# EAGLE design BrainPadWiFi (EAGLE 9.1.3)
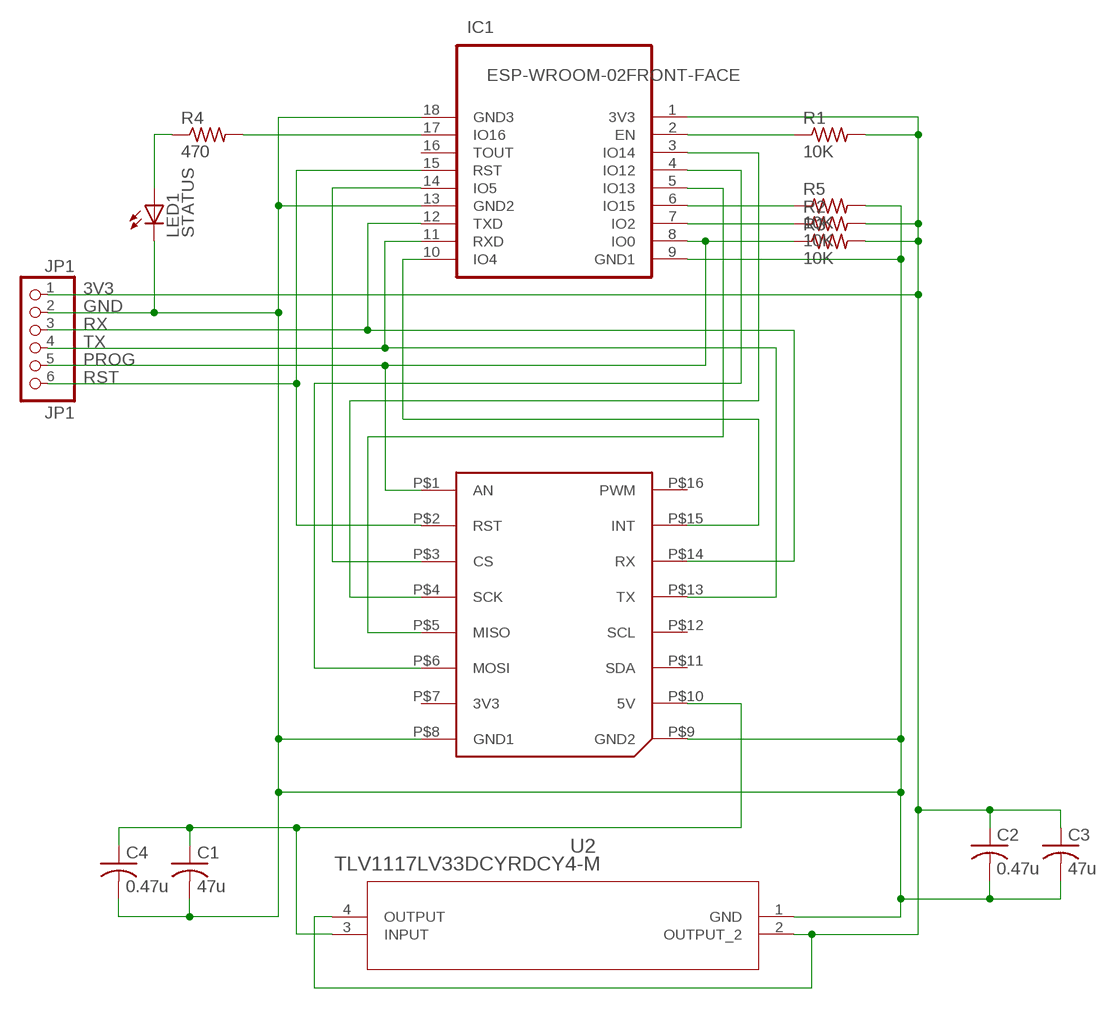
[diagram p0: schematic, sheet 1]

## Parts
C1  47u  C-USC1206  [C1206]
C2  0.47u  C-USC1206  [C1206]
C3  47u  C-USC1206  [C1206]
C4  0.47u  C-USC1206  [C1206]
IC1  ESP-WROOM-02FRONT-FACE  [FRONT-FACE]
JP1  JP1  PINHD-1X6  [1X06]
LED1  STATUS  LEDSML1206  [SML1206]
R1  10K  R-US_R1206  [R1206]
R2  10K  R-US_R1206  [R1206]
R3  10K  R-US_R1206  [R1206]
R4  470  R-US_R1206  [R1206]
R5  10K  R-US_R1206  [R1206]
U2  TLV1117LV33DCYRDCY4-M  [DCY4-M]
U$1  MIKROE_CLICKMINI  [MIKROE_BUS_MINI]

## Nets
3V3: C2.1 C3.1 IC1.1(3V3) JP1.1 R1.2 R2.2 R3.2 U2.2(OUTPUT_2) U2.4(OUTPUT)
5V: C1.1 C4.1 U2.3(INPUT) U$1.P$10(5V)
CS: IC1.14(IO5) U$1.P$3(CS)
EN: IC1.2(EN) R1.1
GND: C1.2 C2.2 C3.2 C4.2 IC1.9(GND1) IC1.13(GND2) IC1.18(GND3) JP1.2 LED1.C R5.2 U2.1(GND) U$1.P$8(GND1) U$1.P$9(GND2)
INT: IC1.10(IO4) U$1.P$15(INT)
IO16: IC1.17(IO16) R4.2
MISO: IC1.5(IO13) U$1.P$5(MISO)
MOSI: IC1.4(IO12) U$1.P$6(MOSI)
N$1: IC1.7(IO2) R2.1
N$4: IC1.6(IO15) R5.1
PROG: IC1.8(IO0) JP1.5 R3.1 U$1.P$1(AN)
RST: IC1.15(RST) JP1.6 U$1.P$2(RST)
RX: IC1.12(TXD) JP1.3 U$1.P$14(RX)
SCK: IC1.3(IO14) U$1.P$4(SCK)
STAT: LED1.A R4.1
TX: IC1.11(RXD) JP1.4 U$1.P$13(TX)
Unconnected: IC1.16(TOUT) U$1.P$7(3V3) U$1.P$11(SDA) U$1.P$12(SCL) U$1.P$16(PWM)

## Library data of the parts
C1-C4 = BrainPadWiFi:C-US: CAPACITOR, American symbol
IC1 = BrainPadWiFi:ESP-WROOM-02: WiFi module - ESP-WROOM-02
JP1 = BrainPadWiFi:PINHD-1X6: PIN HEADER
LED1 = BrainPadWiFi:LED: LED OSRAM: - CHIPLED LG R971, LG N971, LY N971, LG Q971, LY Q971, LO R971, LY R971 LH N974, LH R974 LS Q976, LO Q976, LY Q976 LO Q996 - Hyper CHIPLED LW Q18S LB Q993, LB Q99A, LB R99A - SideLED LS A670, LO A670, LY A670, LG A670, LP A670 LB A673, LV A673, LT A673, LW A673 LH A674 LY A675 LS A676, LA A676, LO A676, LY A676, LW A676 LS A679, LY A679, LG A679 - Hyper Micro SIDELED® LS Y876, LA Y876, LO Y876, LY Y876 LT Y87S - SmartLED LW L88C, LW L88S LB L89C, LB L89S, LG L890 LS L89K, LO L89K, LY L89K LS L896, LA L896, LO L896, LY L896 - TOPLED LS T670, LO T670, LY T670, LG T670, LP T670 LSG T670, LSP T670, LSY T670, LOP T670, LYG T670 LG T671, LOG T671, LSG T671 LB T673, LV T673, LT T673, LW T673 LH T674 LS T676, LA T676, LO T676, LY T676, LB T676, LH T676, LSB T676, LW T676 LB T67C, LV T67C, LT T67C, LS T67K, LO T67K, LY T67K, LW E67C LS E67B, LA E67B, LO E67B, LY E67B, LB E67C, LV E67C, LT E67C LW T67C LS T679, LY T679, LG T679 LS T770, LO T770, LY T770, LG T770, LP T770 LB T773, LV T773, LT T773, LW T773 LH T774 LS E675, LA E675, LY E675, LS T675 LS T776, LA T776, LO T776, LY T776, LB T776 LHGB T686 LT T68C, LB T68C - Hyper Mini TOPLED® LB M676 - Mini TOPLED Santana® LG M470 LS M47K, LO M47K, LY M47K Source: http://www.osram.convergy.de LUXEON: - LUMILED® LXK2-PW12-R00, LXK2-PW12-S00, LXK2-PW14-U00, LXK2-PW14-V00 LXK2-PM12-R00, LXK2-PM12-S00, LXK2-PM14-U00 LXK2-PE12-Q00, LXK2-PE12-R00, LXK2-PE12-S00, LXK2-PE14-T00, LXK2-PE14-U00 LXK2-PB12-K00, LXK2-PB12-L00, LXK2-PB12-M00, LXK2-PB14-N00, LXK2-PB14-P00, LXK2-PB14-Q00 LXK2-PR12-L00, LXK2-PR12-M00, LXK2-PR14-Q00, LXK2-PR14-R00 LXK2-PD12-Q00, LXK2-PD12-R00, LXK2-PD12-S00 LXK2-PH12-R00, LXK2-PH12-S00 LXK2-PL12-P00, LXK2-PL12-Q00, LXK2-PL12-R00 Source: www.luxeon.com KINGBRIGHT: KA-3528ASYC Source: www.kingbright.com
R1-R5 = BrainPadWiFi:R-US_: RESISTOR, American symbol
U2 = BrainPadWiFi:TLV1117LV33DCYR; MANUFACTURER_PART_NUMBER: TLV1117LV33DCYR; VENDOR: Texas Instruments
U$1 = BrainPadWiFi:MIKROE_CLICK

## Board
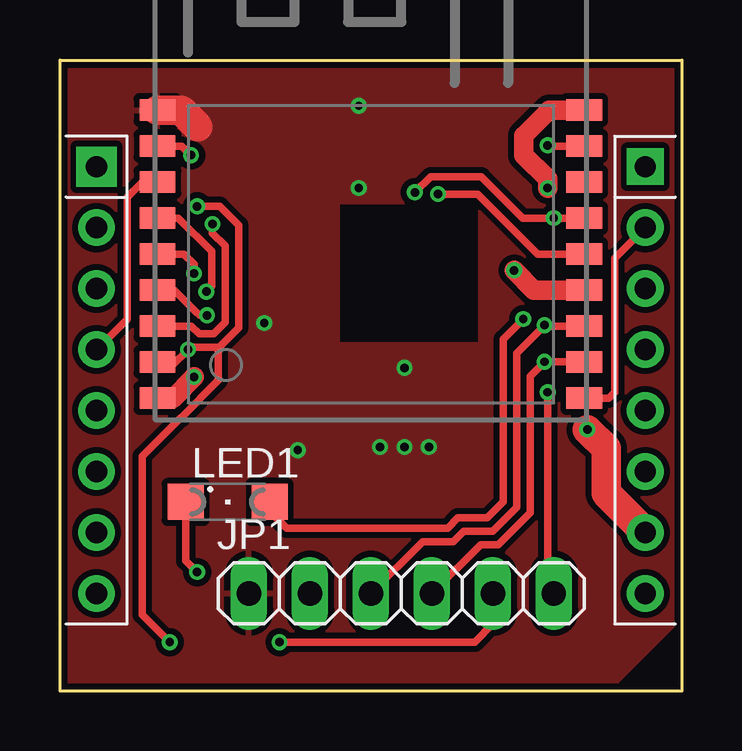
[diagram p1: board, top side]
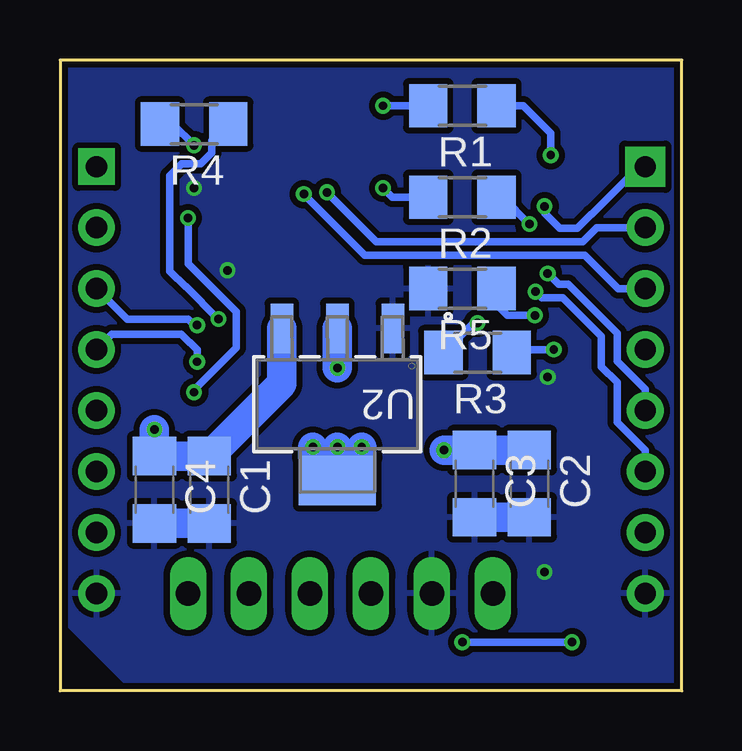
[diagram p2: board, bottom side, seen from below]

Size 25.91 x 26.29 mm. Coordinates in mm from the lower left corner, seen from the top.
Copper layers (1*16): Top 0.035mm / dielectric 1.5mm / Bottom 0.035mm
Design rules "BrainPadWiFi": minimum track width 6mil, minimum drill 12mil, track to track 10mil, track to pad 10mil, pad to pad 0.205mm, via to via 0.205mm, smd to smd 0mil, copper to edge 10mil, drill to drill 10mil, minimum pad ring 10mil, minimum via ring 6mil, stop-mask expansion 2mil, vias tented up to drill 100mil, thermal gap 10mil

### Footprints (pad centres in the part's own frame; a part is rotated, then mirrored left to right if it is on the bottom)
C1206 = smd 1.6 x 1.8: 1 -1.4,0; 2 1.4,0
FRONT-FACE = smd 1.485 x 0.9: 1 -8.893,4.9; 2 -8.893,3.4; 3 -8.893,1.9; 4 -8.893,0.4; 5 -8.893,-1.1; 6 -8.893,-2.6; 7 -8.893,-4.1; 8 -8.893,-5.6; 9 -8.893,-7.1; 10 8.893,-7.1; 11 8.893,-5.6; 12 8.893,-4.1; 13 8.893,-2.6; 14 8.893,-1.1; 15 8.893,0.4; 16 8.893,1.9; 17 8.893,3.4; 18 8.893,4.9
1X06 = drill 1.016 long: 1 -6.35,0; 2 -3.81,0; 3 -1.27,0; 4 1.27,0; 5 3.81,0; 6 6.35,0
SML1206 = smd 1.5 x 1.5: A 1.75,0; C -1.75,0
R1206 = smd 1.6 x 1.803: 1 -1.422,0; 2 1.422,0
DCY4-M = smd 0.94 x 2.07: 1 -2.311,-3.169; 2 0,-3.169; 3 2.311,-3.169 | smd 3.2 x 2.07: 4 0,3.169
MIKROE_BUS_MINI = drill 0.889 pad 1.676 square: P$1 1.27,21.59 | drill 0.889 pad 1.524: P$2 1.27,19.05; P$3 1.27,16.51; P$4 1.27,13.97; P$5 1.27,11.43; P$6 1.27,8.89; P$7 1.27,6.35; P$8 1.27,3.81; P$9 24.13,3.81; P$10 24.13,6.35; P$11 24.13,8.89; P$12 24.13,11.43; P$13 24.13,13.97; P$14 24.13,16.51; P$15 24.13,19.05 | drill 0.889 pad 1.524 square: P$16 24.13,21.59

### Placement (x,y rotation side)
C1  19.68,8.38 270 bottom
C2  6.35,8.64 270 bottom
C3  8.64,8.64 270 bottom
C4  21.97,8.38 270 bottom
IC1  12.95,19.3 0 top
JP1  14.22,4.06 0 top
LED1  6.99,7.87 0 top
R1  9.14,24.38 180 bottom
R2  9.14,20.57 180 bottom
R3  8.51,14.1 180 bottom
R4  20.32,23.62 180 bottom
R5  9.14,16.76 180 bottom
U2  14.35,11.94 180 bottom
U$1  0.25,0.25 0 top

### Tracks (layer width: path | path; a pad name or v marks a point on that pad's centre or on a via)
3V3  (via drill 0.35)
  Top 1.219: 5.74,23.52 5.05,24.2 IC1.1
  Bottom 0.305: v12.45,20.95 12.06,20.57 R2.2 | R1.2 v12.45,24.38 | R3.2 8.7,15.33 v8.51,15.33
  Bottom 1.219: C2.1 C3.1 v9.9,10.04 v9.91,10.03 | U2.2 v14.35,13.46 | U2.4 13.34,9.79 v13.34,10.16 | U2.4 v14.35,10.16 | U2.4 15.37,9.79 v15.37,10.16
  pour Top: 0.25,25.91 25.65,25.91 25.65,2.79 23.11,0.25 0.25,0.25
5V  (via drill 0.35)
  Top 1.219: U$1.P$10 22.76,8.23 22.76,10.1 v21.97,10.89
  Bottom 1.219: v21.97,10.89 C4.1 C1.1 16.66,12.8 U2.3
CS  (via drill 0.35)
  Top 0.305: IC1.14 19.9,18.2 17.4,20.7 v15.75,20.7
  Bottom 0.305: U$1.P$3 2.64,16.76 4.04,18.16 13.21,18.16 v15.75,20.7
EN  (via drill 0.35)
  Top 0.305: IC1.2 5.08,22.7 v5.46,22.32
  Bottom 0.305: 7.74,24.13 R1.1 | 7.72,24.11 R1.1 | v5.46,22.32 5.46,23.24 6.6,24.38 R1.1
GND  (via drill 0.35)
  Top 0.305: LED1.C 5.24,5.43 v5.71,4.95
  Top 0.813: IC1.9 | IC1.9 4.07,12.19 | IC1.18 20.39,24.2 19.33,23.14 19.33,22.32 20.32,21.34 v20.32,20.95 | IC1.9 4.71,12.2 v5.59,13.08 | IC1.13 19.75,16.7 v18.92,17.53
  Bottom 1.219: C4.2 C1.2 | C2.2 C3.2
  pour Bottom: 0.25,25.91 25.65,25.91 25.65,2.79 23.11,0.25 0.25,0.25
INT
  Top 0.305: U$1.P$15 23.11,18.03 23.11,12.45 22.87,12.2 IC1.10
IO16  (via drill 0.35)
  Top 0.305: IC1.17 20.35,22.7 v20.32,22.73
  Bottom 0.305: v20.32,22.73 21.21,23.62 R4.2
MISO  (via drill 0.35)
  Top 0.305: v5.59,17.4 5.59,17.78 5.16,18.2 IC1.5
  Bottom 0.305: v5.59,17.4 5.13,16.94 4.72,16.94 2.69,14.91 2.69,13.74 1.52,12.57 U$1.P$5
MOSI  (via drill 0.35)
  Top 0.305: 4.45,19.7 IC1.4 4.93,19.7 6.32,18.32 6.32,16.86 v6.1,16.64
  Bottom 0.305: v6.1,16.64 5.84,16.38 4.95,16.38 3.35,14.78 3.35,13.51 2.69,12.85 2.69,11.2 1.52,10.03 U$1.P$6
N$1  (via drill 0.35)
  Top 0.305: IC1.7 5.47,15.2 5.79,14.89 6.4,14.89 6.88,15.37 6.88,18.55 6.35,19.08 v6.35,19.45
  Bottom 0.305: v6.35,19.45 7.47,20.57 R2.1
N$4  (via drill 0.35)
  Top 0.305: 4.12,16.76 IC1.6 4.76,16.7 5.7,15.76 5.71,15.76 5.82,15.65 v6.12,15.65
  Bottom 0.305: v6.12,15.65 7.27,15.65 7.72,16.1 R5.1
PROG  (via drill 0.35)
  Top 0.305: IC1.8 3.95,13.59 4.7,13.59 v5.33,14.22 5.44,14.33 6.63,14.33 | JP1.5 18.03,2.79 17.27,2.03 v9.14,2.03 | v4.57,2.03 3.43,3.17 3.43,9.78 5.04,11.39 5.05,11.39 6.6,12.95 6.6,14.3 6.63,14.33 | 6.63,14.33 7.44,15.14 7.44,19.4 6.65,20.19 v5.72,20.19 v5.71,20.19
  Bottom 0.305: R3.1 6.96,14.22 v5.33,14.22 | v9.14,2.03 v4.57,2.03 | v5.71,20.19 5.71,19.91 5.08,19.28 4.35,19.28 3.77,19.86 3.76,19.86 1.78,21.84 U$1.P$1
RST  (via drill 0.35)
  Top 0.305: IC1.15 v20.57,19.7 19.29,19.7 17.55,21.43 15.44,21.43 v14.79,20.77 | v20.32,12.45 20.32,4.32 JP1.6
  Bottom 0.305: U$1.P$2 3.53,19.3 4.12,18.72 12.73,18.72 v14.79,20.77 | v20.57,19.7 20.57,17.8 18.57,15.8 18.57,14.3 20.32,12.55 v20.32,12.45
RX  (via drill 0.35)
  Top 0.305: IC1.12 20.23,15.2 v20.19,15.24 19.03,14.07 19.03,7.65 18.03,6.66 16.82,6.66 16.38,6.22 15.11,6.22 JP1.3
  Bottom 0.305: U$1.P$14 23.11,15.49 20.57,15.49 20.32,15.24 v20.19,15.24
SCK
  Top 0.305: U$1.P$4 2.79,15.49 2.79,20.57 3.42,21.2 IC1.3
STAT  (via drill 0.35)
  Top 0.305: v19.3,15.49 18.47,14.66 18.47,7.88 17.8,7.21 16.58,7.21 16.15,6.78 9.45,6.78 8.73,7.49 LED1.A
  Bottom 0.305: v19.3,15.49 20.64,16.84 20.68,16.84 21.34,17.49 21.34,21.46 20.83,21.97 20.04,21.97 19.59,22.43 19.59,22.93 R4.1
TX  (via drill 0.35)
  Top 0.305: 20.2,13.7 v20.19,13.72 | v20.19,13.72 21.83,13.72 IC1.11 | JP1.4 17.53,6.1 18.27,6.1 19.59,7.42 19.59,13.11 v20.19,13.72
  Bottom 0.305: v20.19,13.72 20.19,14.22 20.48,14.51 20.5,14.51 20.85,14.86 23.75,14.86 U$1.P$13

### Text on the board
Document: BrainPadWiFi 1.01 | STAT | 3.3V | GND | TXD | RXD | PG | RST